# EAGLE schematic Placa_Controle_Velocidade (EAGLE 7.5.0)
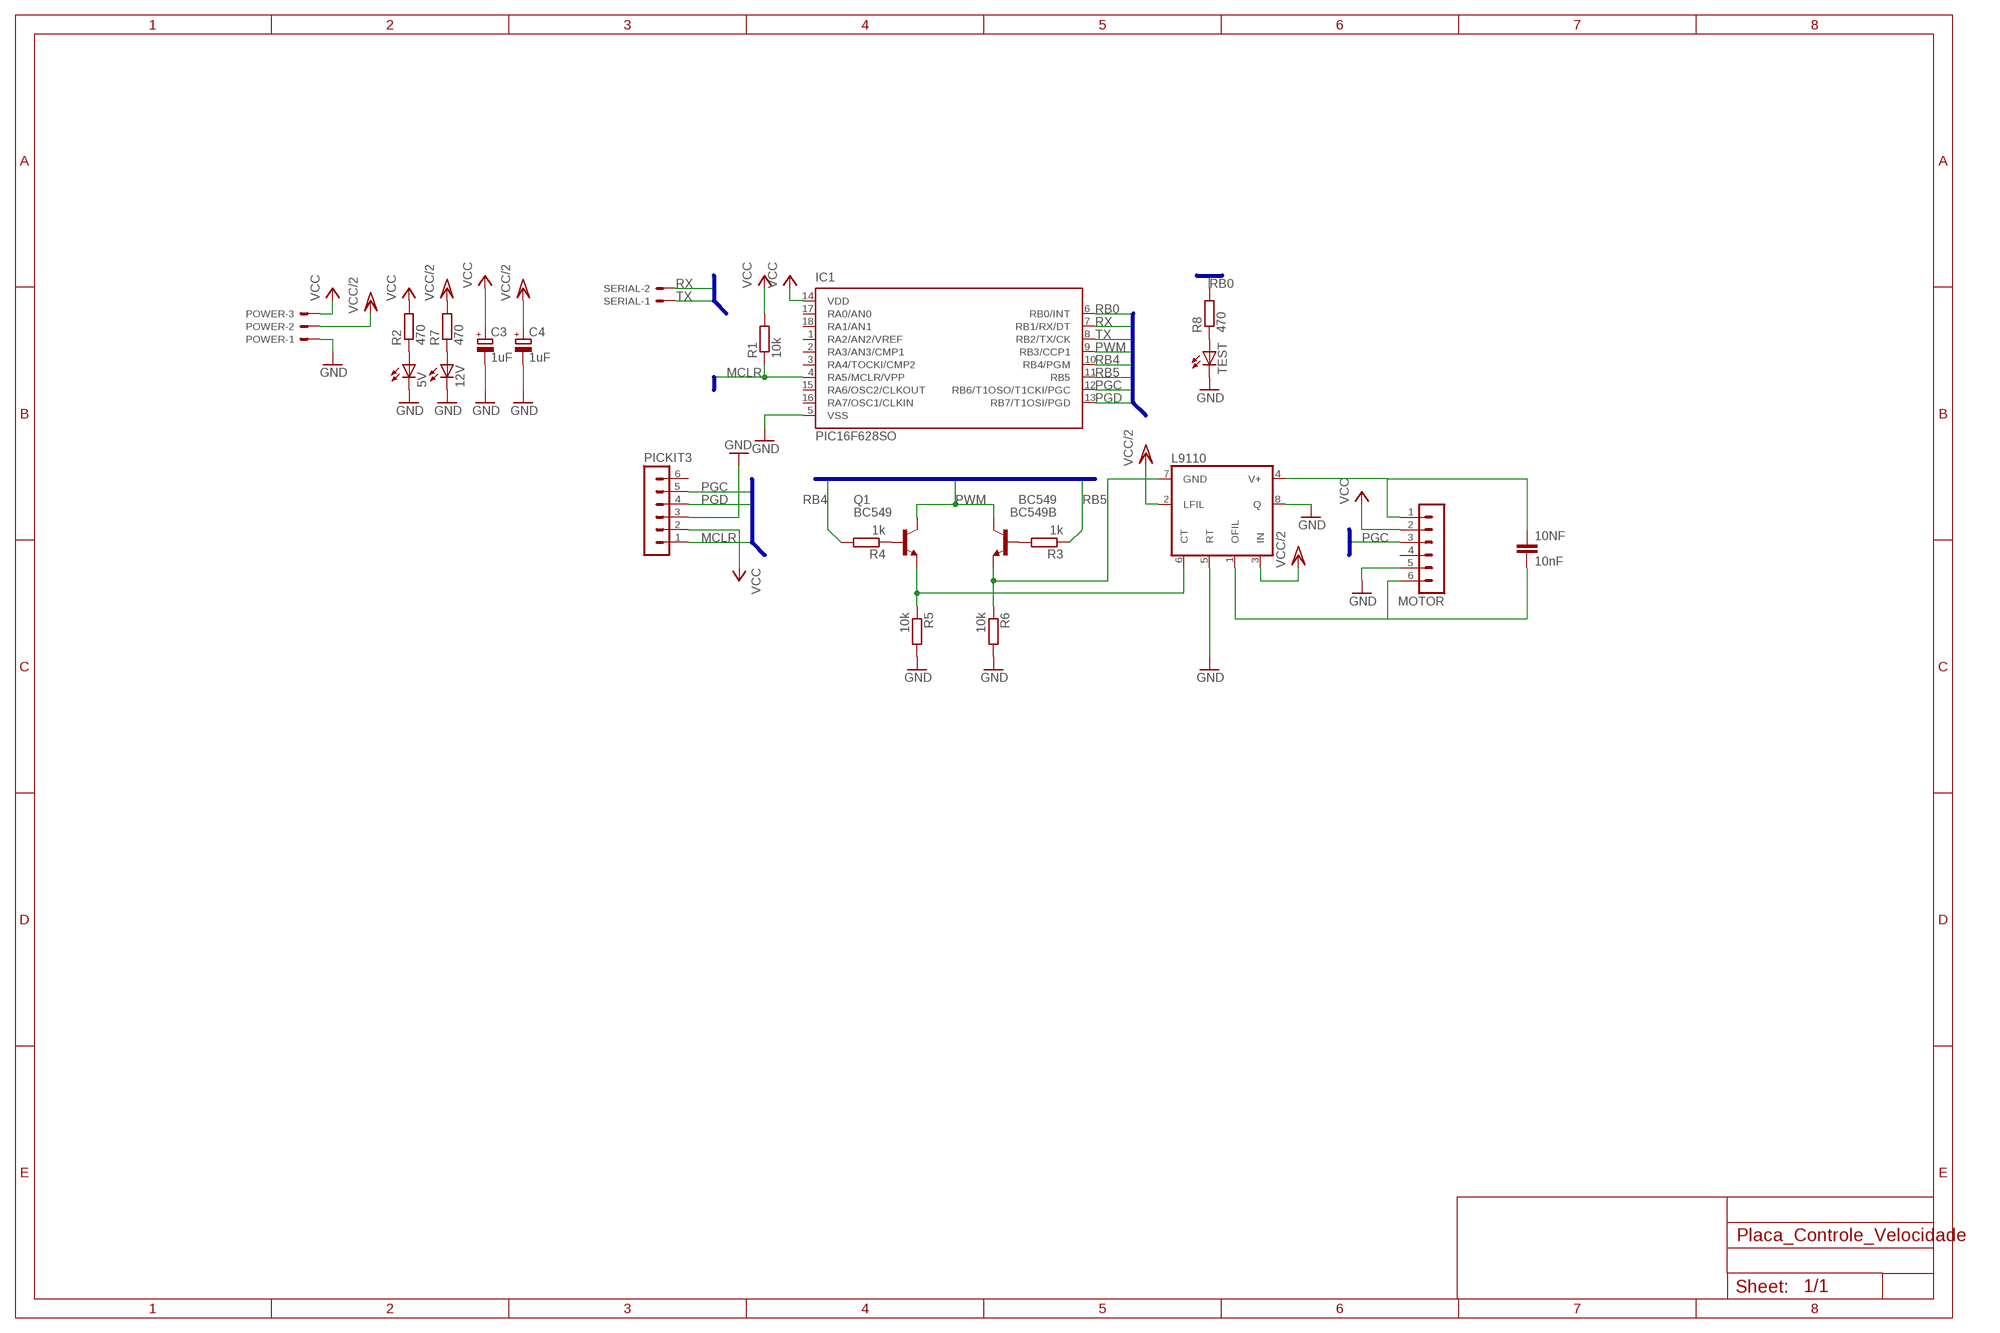
[diagram p0: schematic, sheet 1]

## Parts
5V  LEDCHIPLED_1206  [CHIPLED_1206]
10NF  10nF  C-EUC0603K  [C0603K]
12V  LEDCHIPLED_1206  [CHIPLED_1206]
BC549  BC549B  [TO92-EBC]
C3  1uF  CPOL-EU153CLV-0405  [153CLV-0405]
C4  1uF  CPOL-EU153CLV-0405  [153CLV-0405]
IC1  PIC16F628SO  [SO-18W]
L9110  LM567D  [SO08]
MOTOR  MA06-1  [MA06-1]
PICKIT3  MA06-1  [MA06-1]
POWER  JST-XH-03-PIN-LONG-PAD  [JST-XH-03-PACKAGE-LONG-PAD]
Q1  BC549  BC549B  [TO92-EBC]
R1  10k  R-EU_MELF0102W  [MINI_MELF-0102W]
R2  470  R-EU_MELF0102W  [MINI_MELF-0102W]
R3  1k  R-EU_MELF0102W  [MINI_MELF-0102W]
R4  1k  R-EU_MELF0102W  [MINI_MELF-0102W]
R5  10k  R-EU_MELF0102W  [MINI_MELF-0102W]
R6  10k  R-EU_MELF0102W  [MINI_MELF-0102W]
R7  470  R-EU_MELF0102W  [MINI_MELF-0102W]
R8  470  R-EU_MELF0102W  [MINI_MELF-0102W]
SERIAL  JST-XH-02-PIN-LONG-PAD  [JST-XH-02-PACKAGE-LONG-PAD]
TEST  LEDCHIPLED_1206  [CHIPLED_1206]

## Nets
GND: 5V.C 12V.C C3.- C4.- IC1.5(VSS) L9110.5(RT) L9110.8(Q) MOTOR.5 PICKIT3.3 POWER.1 R5.2 R6.2 TEST.C
MCLR: IC1.4(RA5/MCLR/VPP) PICKIT3.1 R1.1
N$2: 10NF.1 L9110.4(V+) MOTOR.1
N$3: 5V.A R2.1
N$6: BC549.E L9110.7(GND) R6.1
N$7: 10NF.2 L9110.1(OFIL) MOTOR.6
N$9: BC549.B R3.2
N$10: Q1.B R4.1
N$11: 12V.A R7.1
N$13: R8.1 TEST.A
N$14: L9110.6(CT) Q1.E R5.1
PGC: IC1.12(RB6/T1OSO/T1CKI/PGC) MOTOR.3 PICKIT3.5
PGD: IC1.13(RB7/T1OSI/PGD) PICKIT3.4
PWM: BC549.C IC1.9(RB3/CCP1) Q1.C
RB0: IC1.6(RB0/INT) R8.2
RB4: IC1.10(RB4/PGM) R4.2
RB5: IC1.11(RB5) R3.1
RX: IC1.7(RB1/RX/DT) SERIAL.2
TX: IC1.8(RB2/TX/CK) SERIAL.1
VCC: C3.+ IC1.14(VDD) MOTOR.2 PICKIT3.2 POWER.3 R1.2 R2.2
VCC/2: C4.+ L9110.2(LFIL) L9110.3(IN) POWER.2 R7.2
Unconnected: IC1.1(RA2/AN2/VREF) IC1.2(RA3/AN3/CMP1) IC1.3(RA4/TOCKI/CMP2) IC1.15(RA6/OSC2/CLKOUT) IC1.16(RA7/OSC1/CLKIN) IC1.17(RA0/AN0) IC1.18(RA1/AN1) MOTOR.4 PICKIT3.6

## Buses
B$1
B$2
B$3
B$4
B$5
B$6
B$7

## Library data of the parts
5V 12V TEST = led:LED: LED OSRAM: - CHIPLED LG R971, LG N971, LY N971, LG Q971, LY Q971, LO R971, LY R971 LH N974, LH R974 LS Q976, LO Q976, LY Q976 LO Q996 - Hyper CHIPLED LW Q18S LB Q993, LB Q99A, LB R99A - SideLED LS A670, LO A670, LY A670, LG A670, LP A670 LB A673, LV A673, LT A673, LW A673 LH A674 LY A675 LS A676, LA A676, LO A676, LY A676, LW A676 LS A679, LY A679, LG A679 - Hyper Micro SIDELED® LS Y876, LA Y876, LO Y876, LY Y876 LT Y87S - SmartLED LW L88C, LW L88S LB L89C, LB L89S, LG L890 LS L89K, LO L89K, LY L89K LS L896, LA L896, LO L896, LY L896 - TOPLED LS T670, LO T670, LY T670, LG T670, LP T670 LSG T670, LSP T670, LSY T670, LOP T670, LYG T670 LG T671, LOG T671, LSG T671 LB T673, LV T673, LT T673, LW T673 LH T674 LS T676, LA T676, LO T676, LY T676, LB T676, LH T676, LSB T676, LW T676 LB T67C, LV T67C, LT T67C, LS T67K, LO T67K, LY T67K, LW E67C LS E67B, LA E67B, LO E67B, LY E67B, LB E67C, LV E67C, LT E67C LW T67C LS T679, LY T679, LG T679 LS T770, LO T770, LY T770, LG T770, LP T770 LB T773, LV T773, LT T773, LW T773 LH T774 LS E675, LA E675, LY E675, LS T675 LS T776, LA T776, LO T776, LY T776, LB T776 LHGB T686 LT T68C, LB T68C - Hyper Mini TOPLED® LB M676 - Mini TOPLED Santana® LG M470 LS M47K, LO M47K, LY M47K Source: http://www.osram.convergy.de LUXEON: - LUMILED® LXK2-PW12-R00, LXK2-PW12-S00, LXK2-PW14-U00, LXK2-PW14-V00 LXK2-PM12-R00, LXK2-PM12-S00, LXK2-PM14-U00 LXK2-PE12-Q00, LXK2-PE12-R00, LXK2-PE12-S00, LXK2-PE14-T00, LXK2-PE14-U00 LXK2-PB12-K00, LXK2-PB12-L00, LXK2-PB12-M00, LXK2-PB14-N00, LXK2-PB14-P00, LXK2-PB14-Q00 LXK2-PR12-L00, LXK2-PR12-M00, LXK2-PR14-Q00, LXK2-PR14-R00 LXK2-PD12-Q00, LXK2-PD12-R00, LXK2-PD12-S00 LXK2-PH12-R00, LXK2-PH12-S00 LXK2-PL12-P00, LXK2-PL12-Q00, LXK2-PL12-R00 Source: www.luxeon.com KINGBRIGHT: KA-3528ASYC Source: www.kingbright.com
10NF = rcl:C-EU: CAPACITOR, European symbol
BC549 Q1 = transistor-npn:BC549*: NPN Transistor
C3 C4 = rcl:CPOL-EU: POLARIZED CAPACITOR, European symbol
IC1 = microchip:PIC16F62*: FLASH-Based 8-Bit CMOS Microcontroller Source: http://ww1.microchip.com/downloads/en/DeviceDoc/40300C.pdf; MF: MICROCHIP; MPN: PIC16F628-20I/SO; OC_FARNELL: 9760415; OC_NEWARK: 23C4986
L9110 = linear:*567: TONE DECODER
MOTOR PICKIT3 = con-lstb:MA06-1: PIN HEADER; OC_FARNELL: unknown; OC_NEWARK: unknown
POWER = Rembrandt Electronics - JST XH Connectors v1-0:JST-XH-03-PIN: JST XH Connector 2 Pin Wire to board connector. Pitch: 2,54 mm, (0.100") Number of pins: 3 Created by Rembrandt Electronics www.rembrandtelectronics.com
R1-R8 = rcl:R-EU_: RESISTOR, European symbol
SERIAL = Rembrandt Electronics - JST XH Connectors v1-0:JST-XH-02-PIN: JST XH Connector 2 Pin Wire to board connector. Pitch: 2,54 mm, (0.100") Number of pins: 2 Created by Rembrandt Electronics www.rembrandtelectronics.com

## Net classes
0 default: width 0.686 mm, drill 0.229 mm, clearance 0.229 mm